# EAGLE design moodLighting (EAGLE 7.2.0)
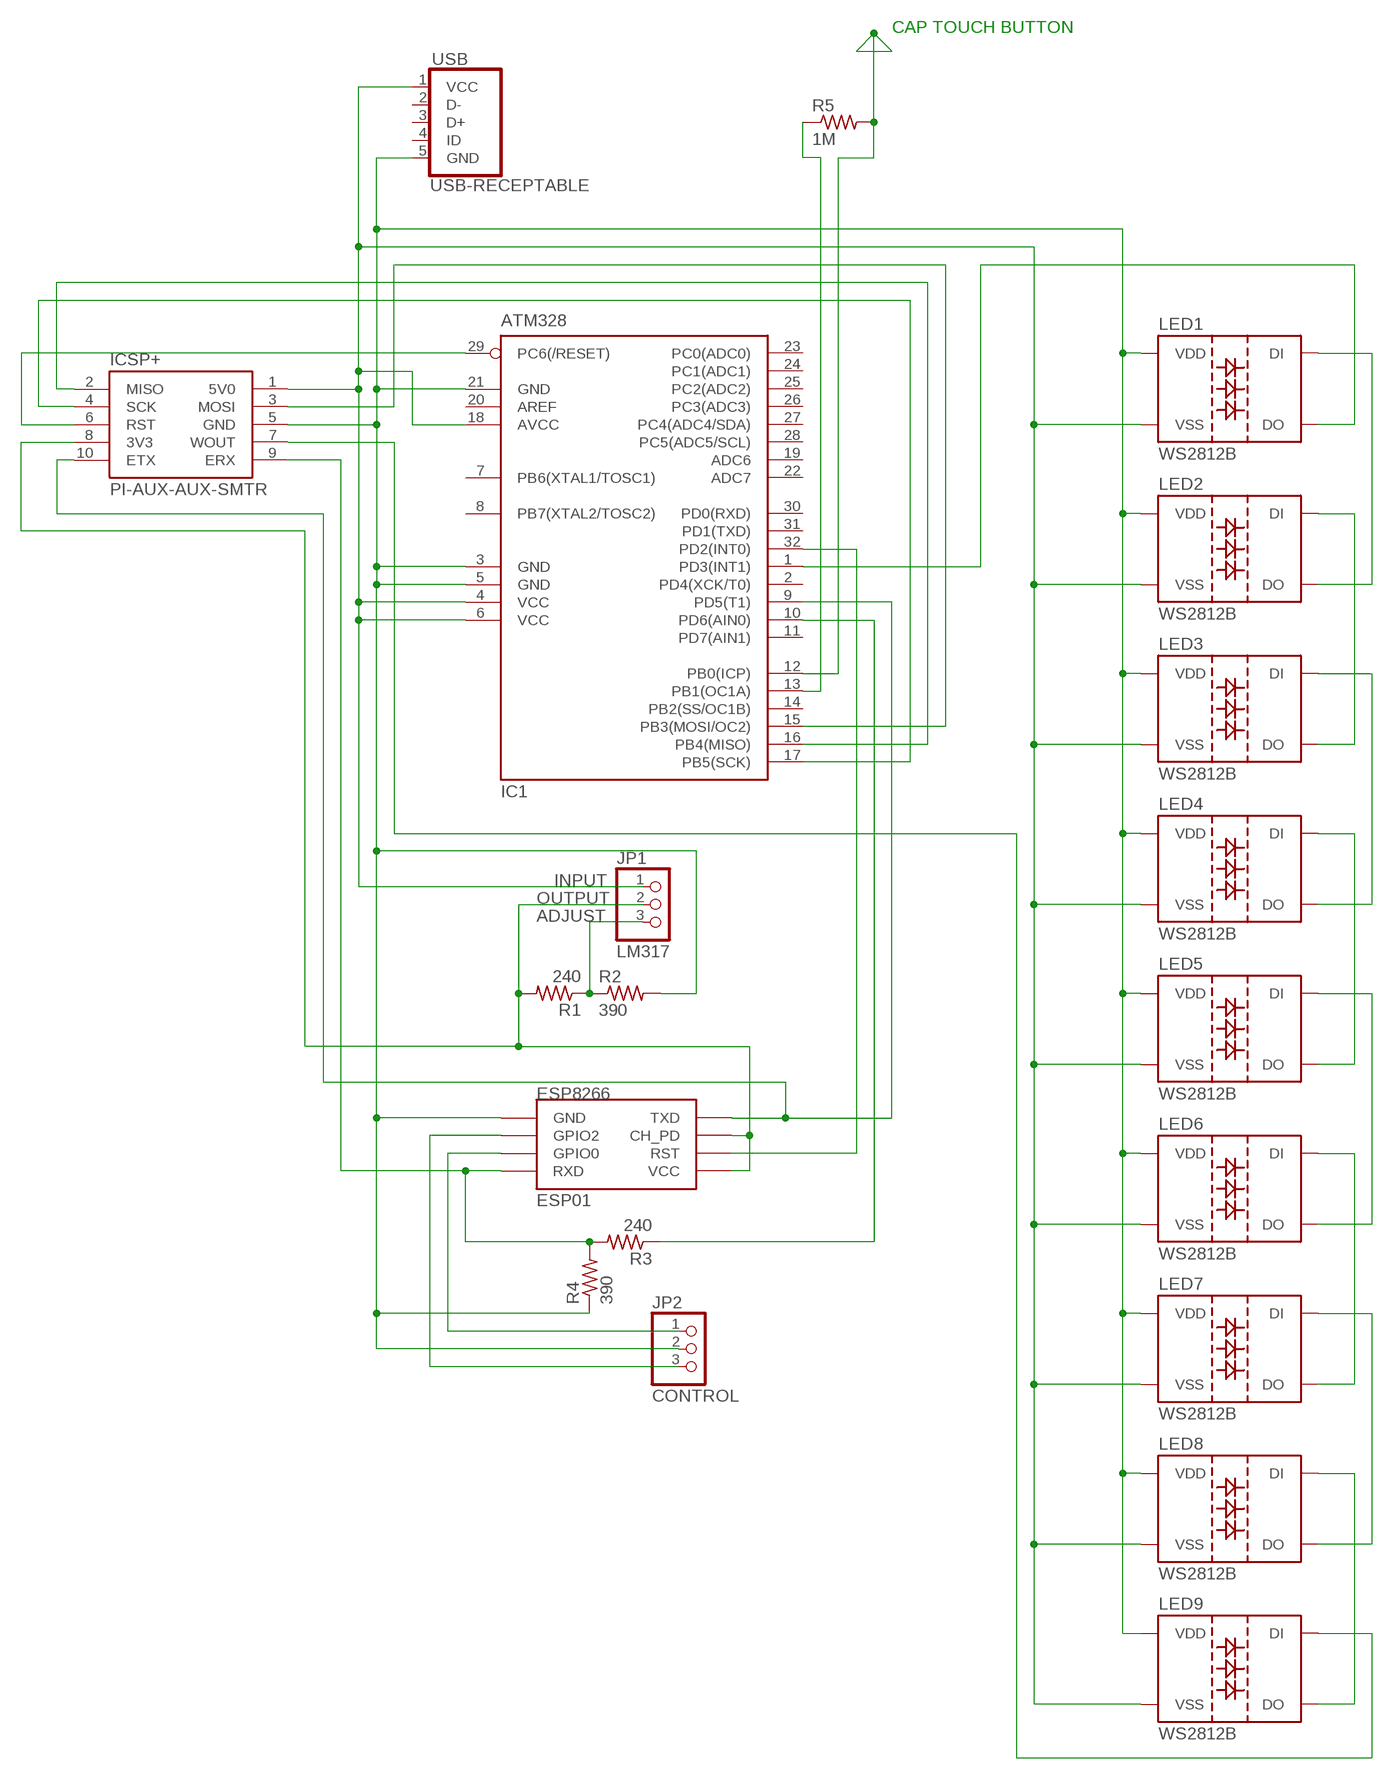
[diagram p0: schematic, sheet 1]

## Parts
ESP8266  ESP01  [ESP01]
IC1  ATM328  MEGA8-AI  [TQFP32-08]
ICSP+  PI-AUX-AUX-SMTR  [GPIO-AUX-CONNECTOR-SMT-REV]
JP1  LM317  PINHD-1X3  [1X03]
JP2  CONTROL  PINHD-1X3  [1X03]
LED1  WS2812B  [WS2812B]
LED2  WS2812B  [WS2812B]
LED3  WS2812B  [WS2812B]
LED4  WS2812B  [WS2812B]
LED5  WS2812B  [WS2812B]
LED6  WS2812B  [WS2812B]
LED7  WS2812B  [WS2812B]
LED8  WS2812B  [WS2812B]
LED9  WS2812B  [WS2812B]
R1  240  R-US_R0805  [R0805]
R2  390  R-US_R0805  [R0805]
R3  240  R-US_R0805  [R0805]
R4  390  R-US_R0805  [R0805]
R5  1M  R-US_R0805  [R0805]
USB  USB-RECEPTABLE  [FCI-10103594-0001LF]

## Nets
CAP: IC1.12(PB0(ICP)) R5.2
N$1: IC1.4(VCC) IC1.6(VCC) IC1.18(AVCC) ICSP+.1(5V0) JP1.1 LED1.3(VSS) LED2.3(VSS) LED3.3(VSS) LED4.3(VSS) LED5.3(VSS) LED6.3(VSS) LED7.3(VSS) LED8.3(VSS) LED9.3(VSS) USB.1(VCC)
N$2: ESP8266.RST IC1.32(PD2(INT0))
N$4: IC1.1(PD3(INT1)) LED1.2(DO)
N$5: LED1.4(DI) LED2.2(DO)
N$6: LED2.4(DI) LED3.2(DO)
N$7: LED3.4(DI) LED4.2(DO)
N$8: LED4.4(DI) LED5.2(DO)
N$9: LED5.4(DI) LED6.2(DO)
N$10: LED6.4(DI) LED7.2(DO)
N$11: LED7.4(DI) LED8.2(DO)
N$12: LED8.4(DI) LED9.2(DO)
N$13: ICSP+.7(WOUT) LED9.4(DI)
N$14: ESP8266.CH_PD ESP8266.VCC ICSP+.8(3V3) JP1.2 R1.2
N$15: JP1.3 R1.1 R2.1
N$16: ESP8266.GND IC1.3(GND) IC1.5(GND) IC1.21(GND) ICSP+.5(GND) JP2.2 LED1.1(VDD) LED2.1(VDD) LED3.1(VDD) LED4.1(VDD) LED5.1(VDD) LED6.1(VDD) LED7.1(VDD) LED8.1(VDD) LED9.1(VDD) R2.2 R4.1 USB.5(GND)
N$17: ESP8266.TX(TXD) IC1.9(PD5(T1)) ICSP+.10(ETX)
N$18: IC1.15(PB3(MOSI/OC2)) ICSP+.3(MOSI)
N$19: IC1.16(PB4(MISO)) ICSP+.2(MISO)
N$20: IC1.10(PD6(AIN0)) R3.1
N$21: ESP8266.RX(RXD) ICSP+.9(ERX) R3.2 R4.2
N$22: ESP8266.GPIO0 JP2.1
N$23: IC1.17(PB5(SCK)) ICSP+.4(SCK)
N$24: IC1.29(PC6(/RESET)) ICSP+.6(RST)
N$26: ESP8266.GPIO2 JP2.3
N$30: IC1.13(PB1(OC1A)) R5.1
Unconnected: IC1.2(PD4(XCK/T0)) IC1.7(PB6(XTAL1/TOSC1)) IC1.8(PB7(XTAL2/TOSC2)) IC1.11(PD7(AIN1)) IC1.14(PB2(SS/OC1B)) IC1.19(ADC6) IC1.20(AREF) IC1.22(ADC7) IC1.23(PC0(ADC0)) IC1.24(PC1(ADC1)) IC1.25(PC2(ADC2)) IC1.26(PC3(ADC3)) IC1.27(PC4(ADC4/SDA)) IC1.28(PC5(ADC5/SCL)) IC1.30(PD0(RXD)) IC1.31(PD1(TXD)) USB.2(D-) USB.3(D+) USB.4(ID)

## Notes on the sheet
- CAP TOUCH BUTTON
- INPUT
- OUTPUT
- ADJUST

## Library data of the parts
ESP8266 = esp8266modules:ESP01: ESP8266 Wifi module 01
IC1 = atmel:MEGA8: MICROCONTROLLER 8 Kbytes FLASH, 1 kbytes SRAM, 512 bytes EEPROM, USART, 6-channel 10 bit ADC, 2-channel 8 bit ADC Pin compatible with Atmega48, ATMega88, ATMega168 Source: avr.lbr; MPN: ATMEGA8-16AU; OC_FARNELL: 9171371; OC_NEWARK: 73M8863
ICSP+ = jt-raspberry-pi:PI-AUX-
JP1 JP2 = pinhead:PINHD-1X3: PIN HEADER
LED1-LED9 = WS2812:WS2812B
R1-R5 = rcl:R-US_: RESISTOR, American symbol
USB = daspilker:USB-RECEPTABLE: USB Receptable

## Board
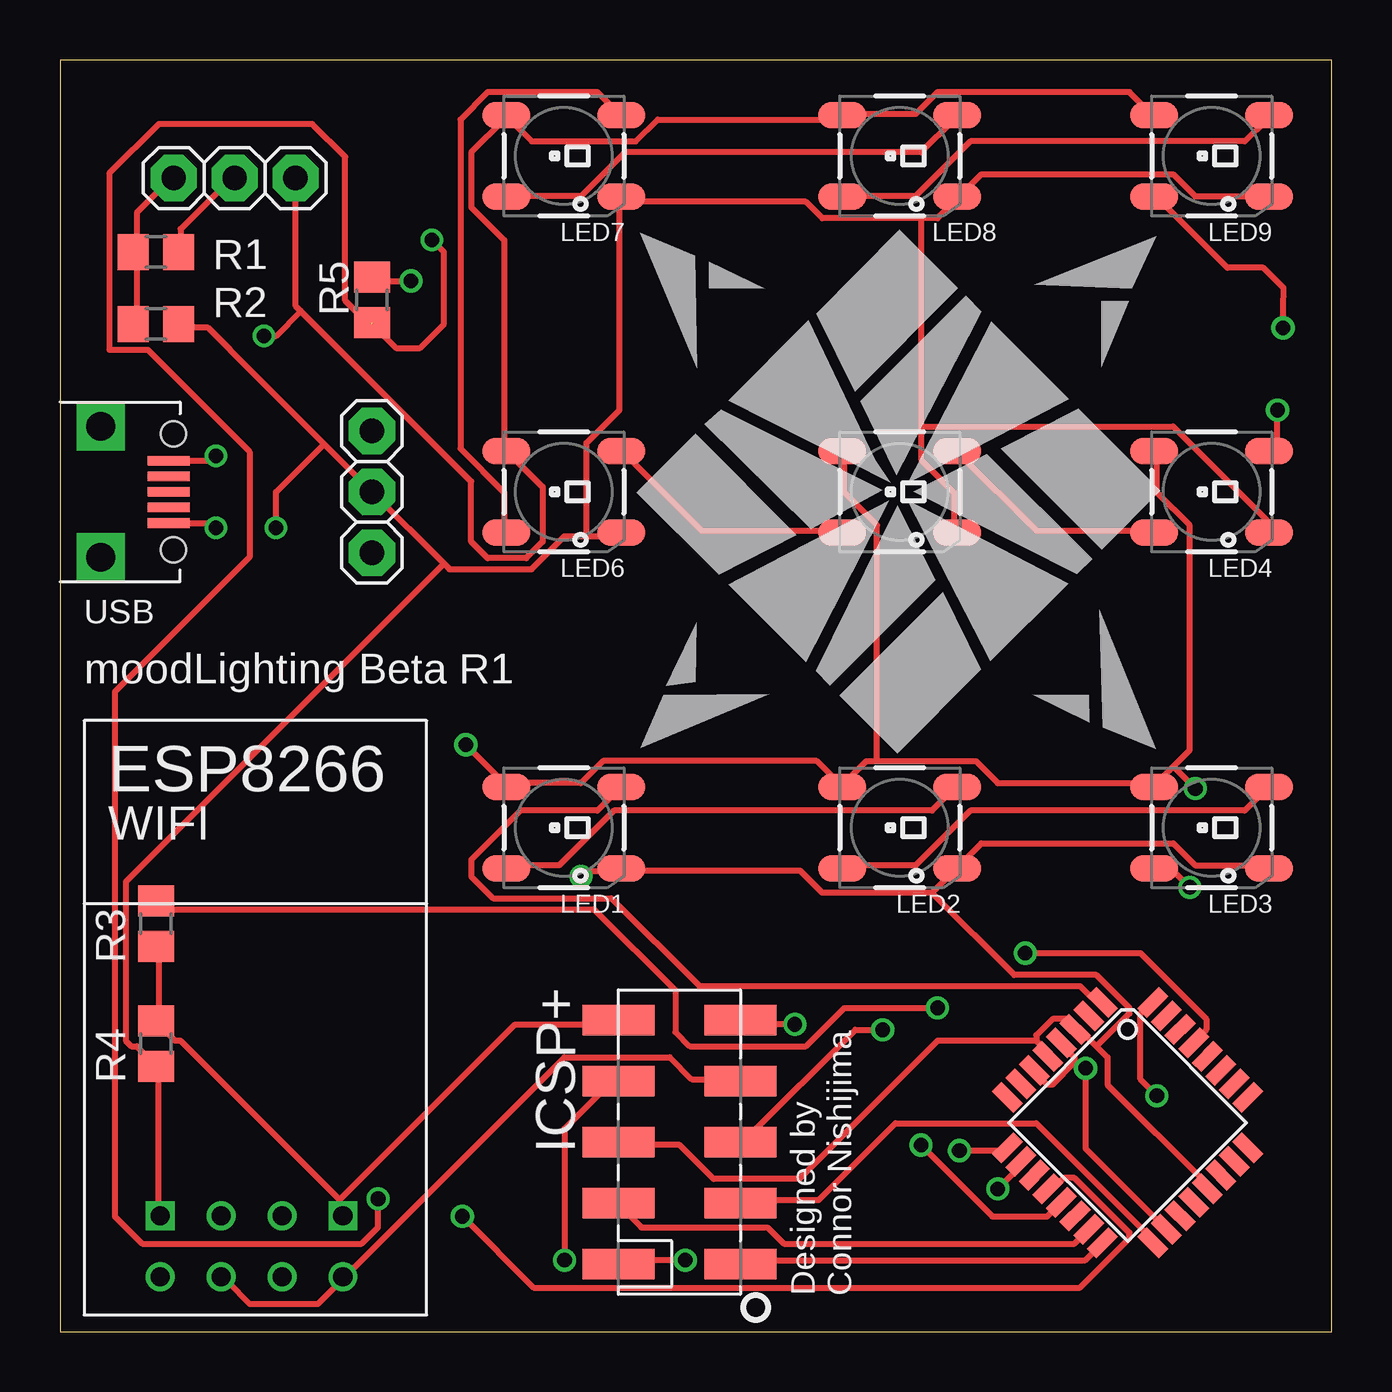
[diagram p1: board, top side]
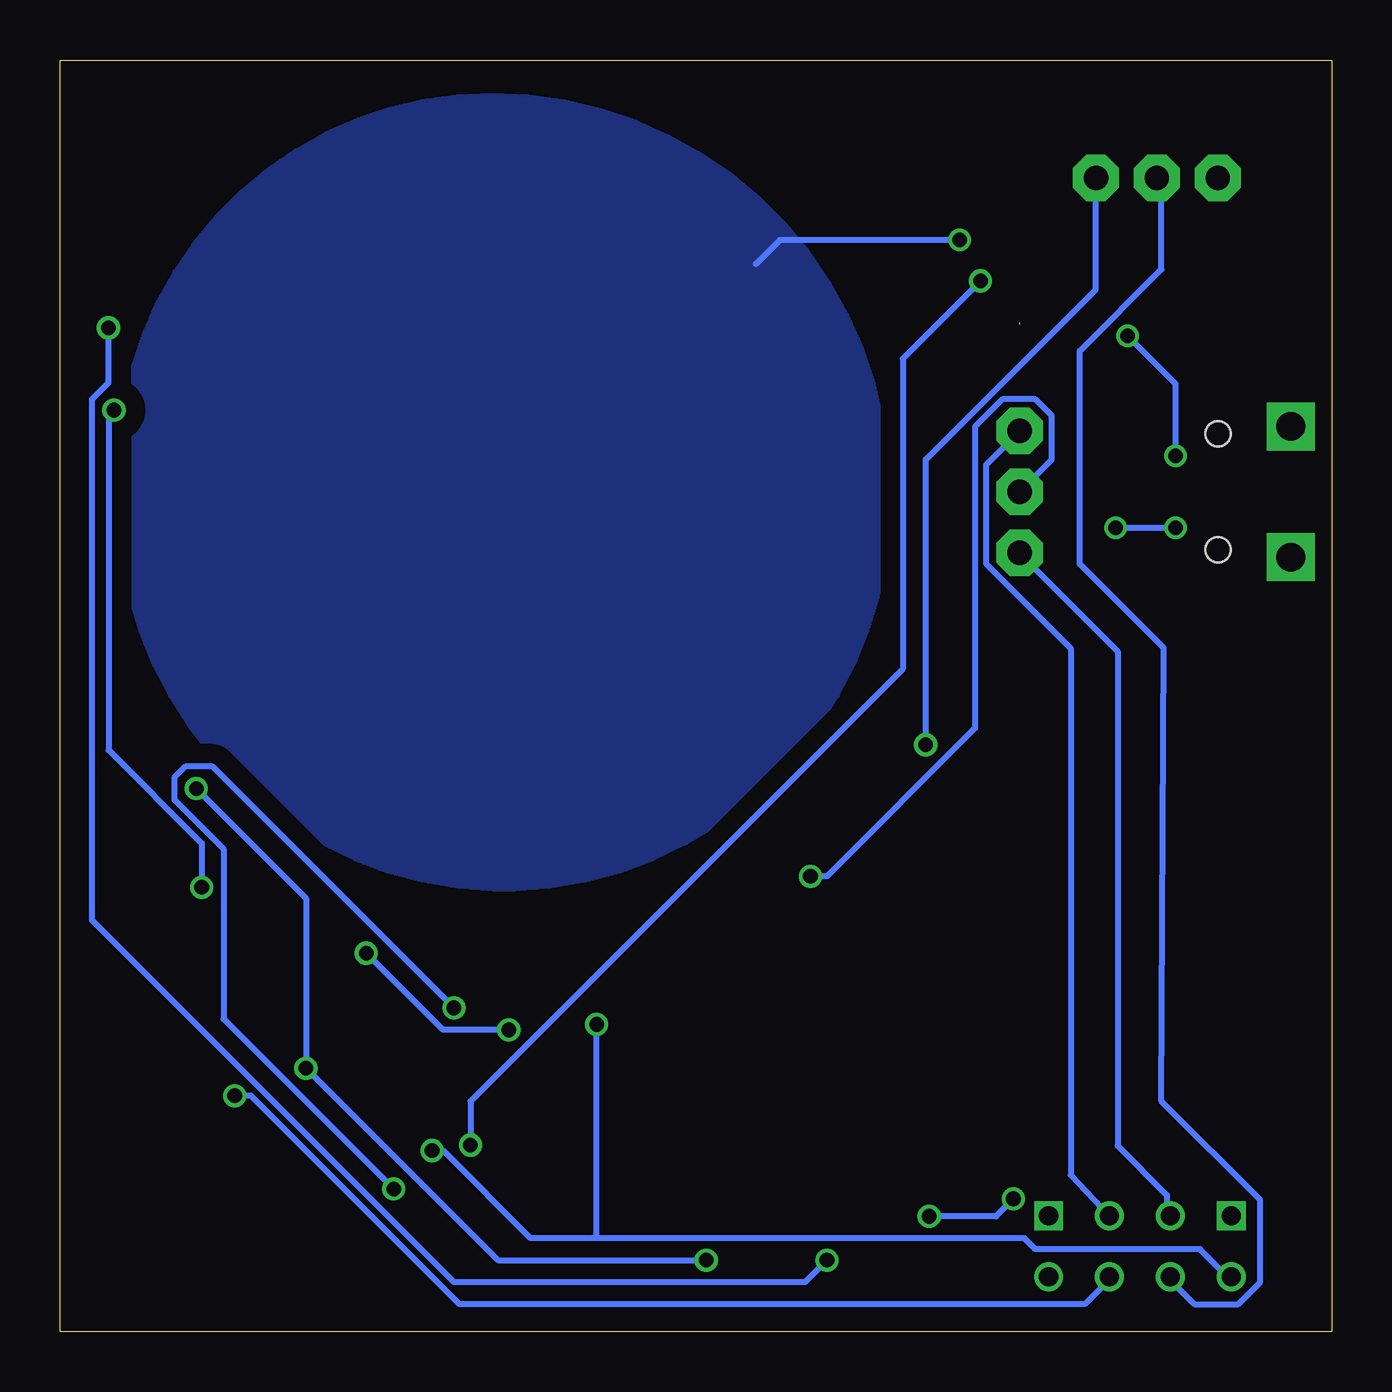
[diagram p2: board, bottom side, seen from below]

Size 53 x 53 mm. Coordinates in mm from the lower left corner, seen from the top.
Outline: 0,0 53,0 53,53 0,53 0,0
Copper layers (1*16): Top 0.0356mm / dielectric 1.5011mm / Bottom 0.0356mm
Design rules "LaenPCBOrder": minimum track width 6mil, minimum drill 13mil, track to track 6mil, track to pad 6mil, pad to pad 6mil, via to via 6mil, smd to smd 6mil, copper to edge 15mil, drill to drill 6mil, minimum pad ring 7mil, minimum via ring 7mil, stop-mask expansion 3mil, vias tented up to drill 0mil, thermal gap 10mil

### Footprints (pad centres in the part's own frame; a part is rotated, then mirrored left to right if it is on the bottom)
ESP01 = drill 0.8: CH_PD -1.285,-8.178; GPIO0 1.255,-5.638; GPIO2 -1.285,-5.638; RST 1.255,-8.178; TX -3.825,-8.178; VCC 3.795,-8.178 | drill 0.8 square: GND -3.825,-5.638; RX 3.795,-5.638
TQFP32-08 = smd 1.27 x 0.559: 1 -4.293,2.8; 2 -4.293,2; 3 -4.293,1.2; 4 -4.293,0.4; 5 -4.293,-0.4; 6 -4.293,-1.2; 7 -4.293,-2; 8 -4.293,-2.8; 17 4.293,-2.8; 18 4.293,-2; 19 4.293,-1.2; 20 4.293,-0.4; 21 4.293,0.4; 22 4.293,1.2; 23 4.293,2; 24 4.293,2.8 | smd 0.559 x 1.27: 9 -2.8,-4.293; 10 -2,-4.293; 11 -1.2,-4.293; 12 -0.4,-4.293; 13 0.4,-4.293; 14 1.2,-4.293; 15 2,-4.293; 16 2.8,-4.293; 25 2.8,4.293; 26 2,4.293; 27 1.2,4.293; 28 0.4,4.293; 29 -0.4,4.293; 30 -1.2,4.293; 31 -2,4.293; 32 -2.8,4.293
GPIO-AUX-CONNECTOR-SMT-REV = smd 1.27 x 3: 1 -3.81,2.54; 2 -3.81,-2.54; 3 -1.27,2.54; 4 -1.27,-2.54; 5 1.27,2.54; 6 1.27,-2.54; 7 3.81,2.54; 8 3.81,-2.54; 9 6.35,2.54; 10 6.35,-2.54
1X03 = drill 1.016 pad 1.93 octagon: 1 -2.54,0; 2 0,0; 3 2.54,0
WS2812B = smd 2 x 1.1: 1 -2.4,1.7; 2 -2.4,-1.7; 3 2.4,-1.7; 4 2.4,1.7
R0805 = smd 1.3 x 1.5: 1 -0.95,0; 2 0.95,0
FCI-10103594-0001LF = smd 0.4 x 1.75: 1 -1.3,4.525; 2 -0.65,4.525; 3 0,4.525; 4 0.65,4.525; 5 1.3,4.525 | drill 1.2 pad 2 square: P$3 -2.725,1.7; P$4 2.725,1.7 | hole 1.05: -2.425,4.73; 2.425,4.73

### Placement (x,y rotation side)
ESP8266  8,10.46 0 top
IC1  44.5,8.71 315 top
ICSP+  25.82,6.63 90 top
JP1  7.28,48.08 180 top
JP2  13,35 270 top
LED1  21,21 180 top
LED2  35,21 180 top
LED3  48,21 180 top
LED4  48,35 180 top
LED5  35,35 180 top
LED6  21,35 180 top
LED7  21,49 180 top
LED8  35,49 180 top
LED9  48,49 180 top
R1  4,45 0 top
R2  4,42 0 top
R3  4,17 270 top
R4  4,12 90 top
R5  13,43 270 top
USB  0,35 270 top

### Tracks (layer width: path | path; a pad name or v marks a point on that pad's centre or on a via)
CAP  (via drill 0.6, 0.61)  (1 unrouted)
  Top 0.254: v16.77,4.8 19.75,1.83 42.52,1.83 44.58,3.89 44.58,4.12 42.29,6.4 41.83,6.4 41.6,6.17 41.38,6.17 IC1.12 | v13.26,5.53 13.26,4.34 12.57,3.66 3.43,3.66 2.29,4.8 2.29,26.66 7.9,32.27 7.9,36.68 3.66,40.92 2.06,40.92 2.06,48.27 4.12,50.33 10.52,50.33 11.89,48.96 11.89,42.98 12.8,42.06 R5.2 | 13,42 14,41 15,41 16,42 16,45 v15.5,45.5
  Bottom 0.254: v16.77,4.8 13.99,4.8 v13.26,5.53 | v15.5,45.5 23,45.5 24,44.5
  pour Bottom (isolate 0.813): 35,51.5 arc-90 50.5,36 50.5,35 arc-90 35,18.5 34,18.5 arc-90 18.5,35 arc-90
N$1  (via drill 0.6, 0.61)
  Top 0.254: LED9.3 45.49,50.75 44.58,51.66 36.58,51.66 35.66,50.75 32.69,50.75 LED8.3 32.46,50.52 24.92,50.52 24,49.61 19.66,49.61 18.75,50.52 LED7.3 18.52,50.52 17.14,49.15 17.14,46.86 18.52,45.49 18.52,36.8 LED6.3 18.75,36.58 20.12,35.2 20.12,32.92 19.43,32.23 17.83,32.23 17.14,32.92 17.14,35.43 10.04,42.54 | 10.04,42.54 9.83,42.75 9.83,48.01 JP1.1 | 42.29,11.2 41.38,10.29 41.15,10.29 40.69,10.74 IC1.6 | 42.29,11.2 42.29,11.43 41.83,11.89 IC1.4 | 34.06,23.77 33.6,23.77 32.69,22.86 LED2.3 32.46,22.86 31.55,23.77 22.63,23.77 21.72,22.86 18.75,22.86 LED1.3 18.52,22.86 v16.92,24.46 | 34.06,23.77 38.18,23.77 39.09,22.86 45.49,22.86 LED3.3 45.72,22.86 46.41,23.55 | 34.06,23.77 34.06,33.6 32.69,34.98 32.69,36.58 LED5.3 | 46.41,23.55 47.09,24.23 47.09,33.6 45.72,34.98 45.72,36.58 LED4.3 | 42.29,11.2 42.52,11.2 v42.75,10.97 42.75,7.63 IC1.18 | 46.41,23.55 v47.32,22.63 | v26.06,2.97 23.32,2.97 ICSP+.1 | USB.1 6.3,36.3 v6.5,36.5 | v8.5,41.5 9,41.5 10.04,42.54
  Bottom 0.254: v47.32,22.63 42.75,18.06 v42.75,10.97 34.75,2.97 v26.06,2.97 | v16.92,24.46 16.92,36.35 9.83,43.43 9.83,48.01 JP1.1 | v6.5,36.5 6.5,39.5 v8.5,41.5
N$2  (via drill 0.61)
  Top 0.254: v45.72,9.83 45.03,10.52 45.03,13.26 45.49,13.72 IC1.32
  Bottom 0.254: v45.72,9.83 45.03,9.83 36.35,1.14 10.29,1.14 9.37,2.06 ESP8266.RST
N$4
  Top 0.254: IC1.1 43.43,13.95 42.98,13.95 42.52,14.4 26.65,14.4 22.99,18.06 18.06,18.06 17.14,18.97 17.14,19.66 19.2,21.72 22.4,21.72 23.32,22.63 LED1.2
N$5
  Top 0.254: LED1.4 18.75,19.43 20.8,19.43 23.09,21.72 36.35,21.72 37.26,22.63 LED2.2
N$6
  Top 0.254: LED2.4 32.69,19.43 35.66,19.43 37.95,21.72 49.38,21.72 50.29,22.63 LED3.2
N$7  (via drill 0.61)
  Top 0.254: v47.09,18.52 46.41,19.2 45.72,19.2 LED3.4 | v50.75,38.41 50.75,37.03 50.52,36.8 LED4.2
  Bottom 0.254: v47.09,18.52 47.09,20.34 50.98,24.23 50.98,38.18 v50.75,38.41
N$8
  Top 0.254: LED4.4 45.49,33.38 40.69,33.38 37.49,36.58 LED5.2
N$9
  Top 0.254: LED5.4 32.46,33.38 26.75,33.38 23.55,36.58 LED6.2
N$10
  Top 0.254: LED6.4 18.52,33.38 18.52,34.98 16.69,36.8 16.69,50.52 17.83,51.66 22.4,51.66 23.32,50.75 LED7.2
N$11
  Top 0.254: LED7.4 18.75,47.32 21.72,47.32 23.55,49.15 35.89,49.15 37.26,50.52 LED8.2
N$12
  Top 0.254: LED8.4 32.69,47.32 35.66,47.32 37.95,49.61 49.38,49.61 50.29,50.52 LED9.2
N$13  (via drill 0.61)
  Top 0.254: v50.98,41.83 51,43.5 50.17,44.33 48.67,44.33 46,47 45.72,47.09 LED9.4 | v21.03,2.97 21.03,8.46 23.09,10.52 ICSP+.7
  Bottom 0.254: v50.98,41.83 50.98,39.55 51.66,38.86 51.66,17.14 36.58,2.06 21.95,2.06 v21.03,2.97
N$14
  Top 0.254: R1.2 5.03,45.03 5.03,45.95 7.09,48.01 JP1.2 | ESP8266.CH_PD 6.86,2.06 7,2.06 7.92,1.14 10.74,1.14 11.66,2.06 ESP8266.VCC 11.89,2.29 21.03,11.43 25.42,11.43 26.33,10.52 28.35,10.52 ICSP+.8
  Bottom 0.254: JP1.2 7.09,48.01 7.09,44.28 10.5,40.87 10.5,32 7,28.5 7.09,9.6 2.97,5.49 2.97,2.06 3.89,1.14 5.71,1.14 6.63,2.06 ESP8266.CH_PD
N$15
  Top 0.254: 3,45 R1.1 | R2.1 3.2,42.06 3.2,44.81 R1.1 | R1.1 3.2,45.03 3.2,46.63 4.57,48.01 JP1.3
N$16  (via drill 0.6, 0.61)
  Top 0.254: 35.89,46.41 36.58,46.41 37.26,47.09 LED8.1 37.49,47.32 38.41,48.23 46.41,48.23 47.32,47.32 50.29,47.32 LED9.1 | 35.89,46.41 31.77,46.41 31.09,47.09 23.55,47.09 LED7.1 23.32,47.09 23.32,38.41 21.95,37.03 21.95,33.15 | 35.89,46.41 35.89,37.72 | 35.89,37.72 35.89,36.35 37.26,34.98 37.26,33.38 LED5.1 | 35.89,37.72 46.41,37.72 50.29,33.83 50.29,33.38 LED4.1 | 36.35,18.29 31.77,18.29 30.86,19.2 23.55,19.2 LED1.1 23.32,19.2 21.95,19.2 v21.72,18.97 | 36.35,18.29 37.26,19.2 LED2.1 37.49,19.43 38.41,20.34 46.41,20.34 47.32,19.43 50.29,19.43 LED3.1 | 40.69,12.12 41.15,11.66 IC1.5 | 40.69,12.12 40.69,12.34 41.38,13.03 42.06,13.03 42.29,12.8 IC1.3 42.52,12.57 43.2,11.89 | 43.2,11.89 43.66,11.43 43.66,10.29 47.78,6.17 IC1.21 | 40.69,12.12 36.58,12.12 30.82,6.36 27.25,6.36 25.83,7.77 23.32,7.77 ICSP+.5 | 36.35,18.29 39.78,14.86 43.2,14.86 44.58,13.49 44.58,13.26 43.2,11.89 | ESP8266.GND 4.12,5.03 4.12,10.97 R4.1 3.89,11.2 3.2,11.89 2.97,11.89 2.74,12.12 2.74,18.75 16,32 | 11,37 12.8,35.2 JP2.2 13.03,34.98 16,32 | 11,37 8,40 6.17,41.83 5.03,41.83 R2.2 | 21.95,33.15 21.03,33.15 19.66,31.77 16.23,31.77 16,32 | 21.95,33.15 23.32,33.15 LED6.1 | USB.5 6.3,33.7 v6.5,33.5 | v9,33.5 9,35 11,37
  Bottom 0.254: v21.72,18.97 21.03,18.97 14.86,25.15 14.86,37.72 13.72,38.86 12.34,38.86 11.66,38.18 11.66,36.35 12.8,35.2 JP2.2 | v6.5,33.5 v9,33.5
N$17  (via drill 0.61)
  Top 0.254: v37.49,7.54 39.32,7.54 IC1.9 | v30.63,12.8 28.57,12.8 ICSP+.10
  Bottom 0.254: v37.49,7.54 37.03,7.54 33.38,3.89 30.63,3.89 | 30.63,3.89 12.8,3.89 12.34,3.43 5.49,3.43 4.34,2.29 ESP8266.TX | 30.63,3.89 v30.63,12.8
N$18
  Top 0.254: IC1.15 42.75,4.12 42.29,3.66 30.18,3.66 29.49,4.34 24.23,4.34 23.32,5.26 ICSP+.3
N$19
  Top 0.254: IC1.16 43.43,3.66 42.75,2.97 28.57,2.97 ICSP+.2
N$20  (via drill 0.61)
  Top 0.254: v39.09,5.94 40.01,6.86 IC1.10 | v36.58,13.49 32.69,13.49 31.09,11.89 26.25,11.89 25.65,12.49 25.65,14.22 22.26,17.6 4.34,17.6 4.12,17.83 R3.1
  Bottom 0.254: v39.09,5.94 46.18,13.03 46.18,20.12 48.23,22.17 48.23,23.09 47.78,23.55 46.63,23.55 v36.58,13.49
N$21
  Top 0.254: R3.2 4.12,16 4.12,13.03 R4.2 4.12,12.8 4.8,12.12 5.03,12.12 11.66,5.49 | 11.66,5.49 11.66,5.03 ESP8266.RX | 11.66,5.49 18.97,12.8 23.09,12.8 ICSP+.9
N$22
  Bottom 0.254: ESP8266.GPIO0 10.87,6.53 10.87,28.48 14.4,32 14.4,36.12 13.03,37.49 JP2.1
N$23
  Top 0.254: IC1.17 45.49,3.89 40.69,8.69 34.83,8.69 31.63,5.49 28.57,5.49 ICSP+.4
N$24  (via drill 0.61)
  Top 0.254: v40.23,15.77 45.03,15.77 47.78,13.03 47.78,12.57 47.32,12.12 IC1.29 | v34.29,12.57 33.15,12.57 28.57,8 ICSP+.6
  Bottom 0.254: v40.23,15.77 37.03,12.57 v34.29,12.57
N$26
  Bottom 0.254: ESP8266.GPIO2 6.86,5.03 6.86,5.69 8.91,7.74 8.91,28.35 12.8,32.23 JP2.3
N$27  (via drill 0.6)
  other vias: 6.5,33.5
N$30  (via drill 0.61)
  Top 0.254: v35.89,7.77 38.86,4.8 41.15,4.8 41.6,5.26 IC1.13 | v14.63,43.79 13.21,43.79 13,44 13.03,43.89 R5.1
  Bottom 0.254: v35.89,7.77 35.89,9.6 17.87,27.62 17.87,40.55 v14.63,43.79

### Text on the board
tPlace: USB | ESP8266 | WIFI
tNames: moodLighting Beta R1 | Designed by / Connor Nishijima